# EAGLE design 6301_FP_second_try (EAGLE 7.7.0)
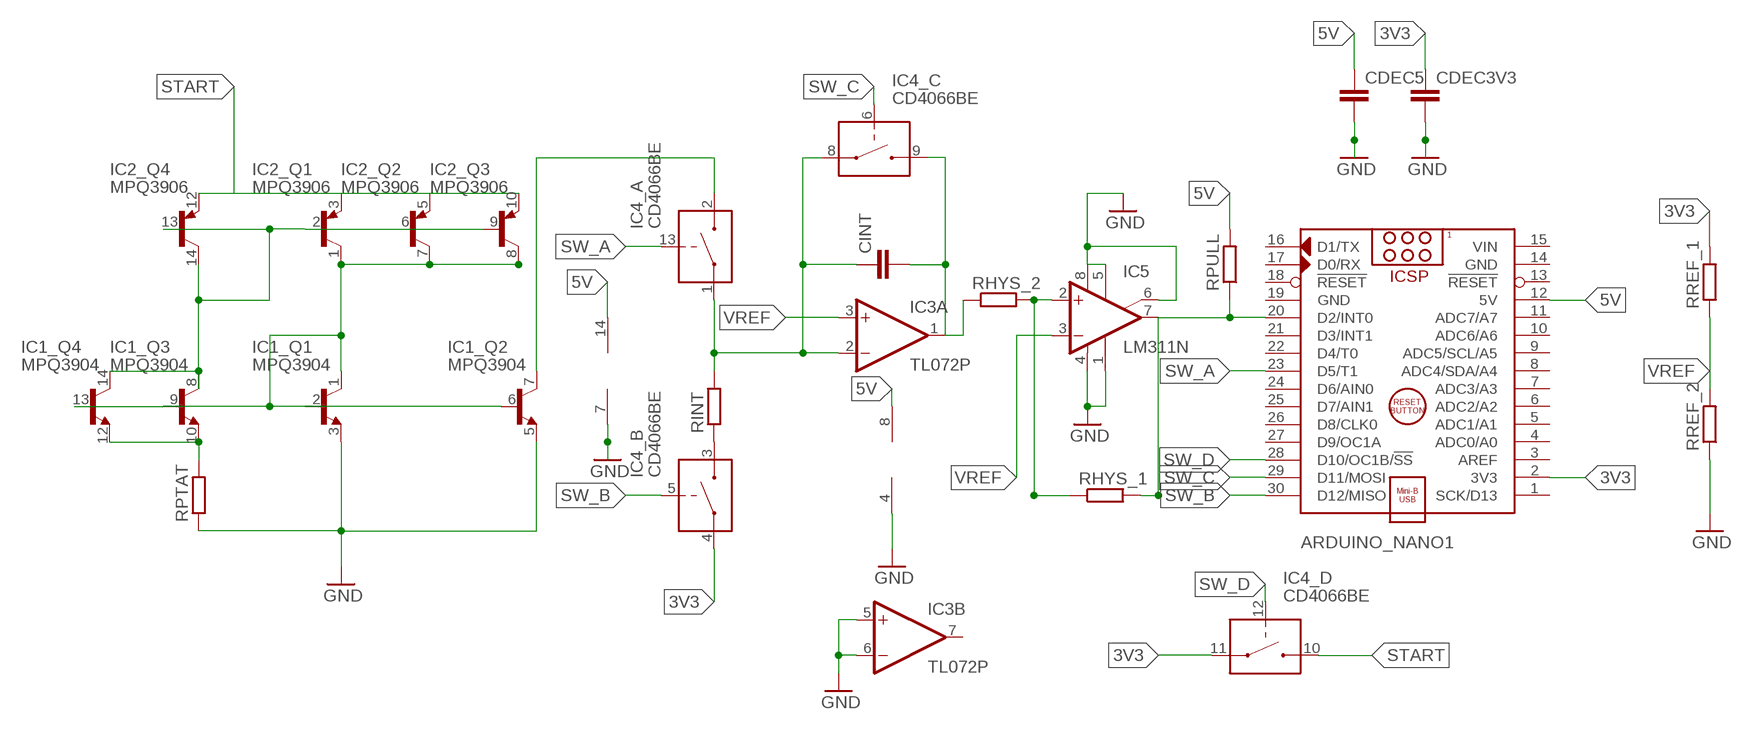
[diagram p0: schematic, sheet 1]

## Parts
ARDUINO_NANO1  ARDUINO_NANO  [ARDUINO_NANO]
CDEC3V3  C-EU025-024X044  [C025-024X044]
CDEC5  C-EU025-024X044  [C025-024X044]
CINT  C-EU025-024X044  [C025-024X044]
IC1  MPQ3904  [DIL14]
IC2  MPQ3906  [DIL14]
IC3  TL072P  [DIL08]
IC4  CD4066BE  [DIL14]
IC5  LM311N  [DIL08]
RHYS_1  R-EU_0204/7  [0204/7]
RHYS_2  R-EU_0204/7  [0204/7]
RINT  R-EU_0204/7  [0204/7]
RPTAT  R-EU_0204/7  [0204/7]
RPULL  R-EU_0204/7  [0204/7]
RREF_1  R-EU_0204/7  [0204/7]
RREF_2  R-EU_0204/7  [0204/7]

## Nets
3V3: ARDUINO_NANO1.2(3V3) CDEC3V3.1 IC4.4(_B:IN/OUT1) IC4.11(_D:IN/OUT1) RREF_1.2
5V: ARDUINO_NANO1.12(5V) CDEC5.1 IC3.8(P:V+) IC4.14(V+) RPULL.2
GND: CDEC3V3.2 CDEC5.2 IC1.3(_Q1:E) IC1.5(_Q2:E) IC3.4(P:V-) IC3.5(B:+IN) IC3.6(B:-IN) IC4.7(V-) IC5.1(GND) IC5.4(V-) IC5.5(ON) IC5.6(ON/STR) IC5.8(V+) RPTAT.1 RREF_2.1
N$1: IC4.3(_B:IN/OUT2) RINT.1
N$2: IC1.10(_Q3:E) IC1.12(_Q4:E) RPTAT.2
N$3: IC1.8(_Q3:C) IC1.14(_Q4:C) IC2.2(_Q1:B) IC2.6(_Q2:B) IC2.9(_Q3:B) IC2.13(_Q4:B) IC2.14(_Q4:C)
N$4: ARDUINO_NANO1.20(D2/INT0) IC5.7(OUT) RHYS_1.2 RPULL.1
N$5: IC1.1(_Q1:C) IC1.2(_Q1:B) IC1.6(_Q2:B) IC1.9(_Q3:B) IC1.13(_Q4:B) IC2.1(_Q1:C) IC2.7(_Q2:C) IC2.8(_Q3:C)
N$6: CINT.2 IC3.1(A:OUT) IC4.9(_C:IN/OUT2) RHYS_2.1
N$9: IC1.7(_Q2:C) IC4.2(_A:IN/OUT2)
N$10: CINT.1 IC3.2(A:-IN) IC4.1(_A:IN/OUT1) IC4.8(_C:IN/OUT1) RINT.2
START: IC2.3(_Q1:E) IC2.5(_Q2:E) IC2.10(_Q3:E) IC2.12(_Q4:E) IC4.10(_D:IN/OUT2)
SW_A: ARDUINO_NANO1.23(D5/T1) IC4.13(_A:CONTROL)
SW_B: ARDUINO_NANO1.30(D12/MISO) IC4.5(_B:CONTROL)
SW_C: ARDUINO_NANO1.29(D11/MOSI) IC4.6(_C:CONTROL)
SW_D: ARDUINO_NANO1.28(D10/OC1B/!SS) IC4.12(_D:CONTROL)
VREF: IC3.3(A:+IN) IC5.2(+IN) IC5.3(-IN) RHYS_1.1 RHYS_2.2 RREF_1.1 RREF_2.2
Unconnected: ARDUINO_NANO1.1(SCK/D13) ARDUINO_NANO1.3(AREF) ARDUINO_NANO1.4(ADC0/A0) ARDUINO_NANO1.5(ADC1/A1) ARDUINO_NANO1.6(ADC2/A2) ARDUINO_NANO1.7(ADC3/A3) ARDUINO_NANO1.8(ADC4/SDA/A4) ARDUINO_NANO1.9(ADC5/SCL/A5) ARDUINO_NANO1.10(ADC6/A6) ARDUINO_NANO1.11(ADC7/A7) ARDUINO_NANO1.13(!RESET) ARDUINO_NANO1.16(D1/TX) ARDUINO_NANO1.17(D0/RX) ARDUINO_NANO1.18(!RESET) ARDUINO_NANO1.21(D3/INT1) ARDUINO_NANO1.22(D4/T0) ARDUINO_NANO1.24(D6/AIN0) ARDUINO_NANO1.25(D7/AIN1) ARDUINO_NANO1.26(D8/CLK0) ARDUINO_NANO1.27(D9/OC1A) IC3.7(B:OUT)

## Power pins joined to a net without a drawn wire
GND: ARDUINO_NANO1.14(GND) ARDUINO_NANO1.19(GND)
VIN: ARDUINO_NANO1.15(VIN)

## Library data of the parts
ARDUINO_NANO1 = 6301-temp-sensor-rev1:ARDUINO_NANO: Arduino Nano V3.0 Module Overview: The Arduino Nano is a small, complete, and breadboard-friendly board based on the ATmega328 (Arduino Nano 3.x) or ATmega168 (Arduino Nano 2.x). It has more or less the same functionality of the Arduino Duemilanove, but in a different package. It lacks only a DC power jack, and works with a Mini-B USB cable instead of a standard one. The Nano was designed and is being produced by Gravitech <http://www.gravitech.us/arna30wiatp.html>. General specifications: Item Value Microcontroller Atmel ATmega168 or ATmega328 Operating Voltage (logic level) 5 V Input Voltage (recommended) 7-12 V Input Voltage (limits) 6-20 V Digital I/O Pins 14 (of which 6 provide PWM output) Analog Input Pins 8 DC Current per I/O Pin 40 mA Flash Memory 16 KB (ATmega168) or 32 KB (ATmega328) of which 2 KB used by bootloader SRAM 1 KB (ATmega168) or 2 KB (ATmega328) EEPROM 512 bytes (ATmega168) or 1 KB (ATmega328) Clock Speed 16 MHz Dimensions (Inches) 0.73" x 1.70" Dimensions (mm) 18mm x 45mm Overall height About 9 mm (not including pins) Weigth 5 g Power: The Arduino Nano can be powered via the Mini-B USB connection, 6-20V unregulated external power supply (pin 30), or 5V regulated external power supply (pin 27). The power source is automatically selected to the highest voltage source. Memory: The ATmega168 has 16 KB of flash memory for storing code (of which 2 KB is used for the bootloader); the ATmega328 has 32 KB, (also with 2 KB used for the bootloader). The ATmega168 has 1 KB of SRAM and 512 bytes of EEPROM (which can be read and written with the EEPROM library); the ATmega328 has 2 KB of SRAM and 1 KB of EEPROM. Input and Output: Each of the 14 digital pins on the Nano can be used as an input or output, using pinMode(), digitalWrite(), and digitalRead() functions. They operate at 5 volts. Each pin can provide or receive a maximum of 40 mA and has an internal pull-up resistor (disconnected by default) of 20-50 kOhms. In addition, some pins have specialized functions. Visit Arduino - ArduinoBoardNano <https://www.arduino.cc/en/Main/ArduinoBoardNano>
CDEC3V3 CDEC5 CINT = rcl:C-EU: CAPACITOR, European symbol
IC1 = 6301-temp-sensor-rev1:MPQ3904
IC2 = 6301-temp-sensor-rev1:MPQ3906
IC3 = 6301-temp-sensor-rev1:TL072: OP AMP
IC4 = 6301-temp-sensor-rev1:CD4066BE
IC5 = 6301-temp-sensor-rev1:LM311: COMPARATOR
RHYS_1 RHYS_2 RINT RPTAT RPULL RREF_1 RREF_2 = rcl:R-EU_: RESISTOR, European symbol

## Net classes
0 default: width 0.406 mm, drill 0.406 mm, clearance 0.406 mm

## Board
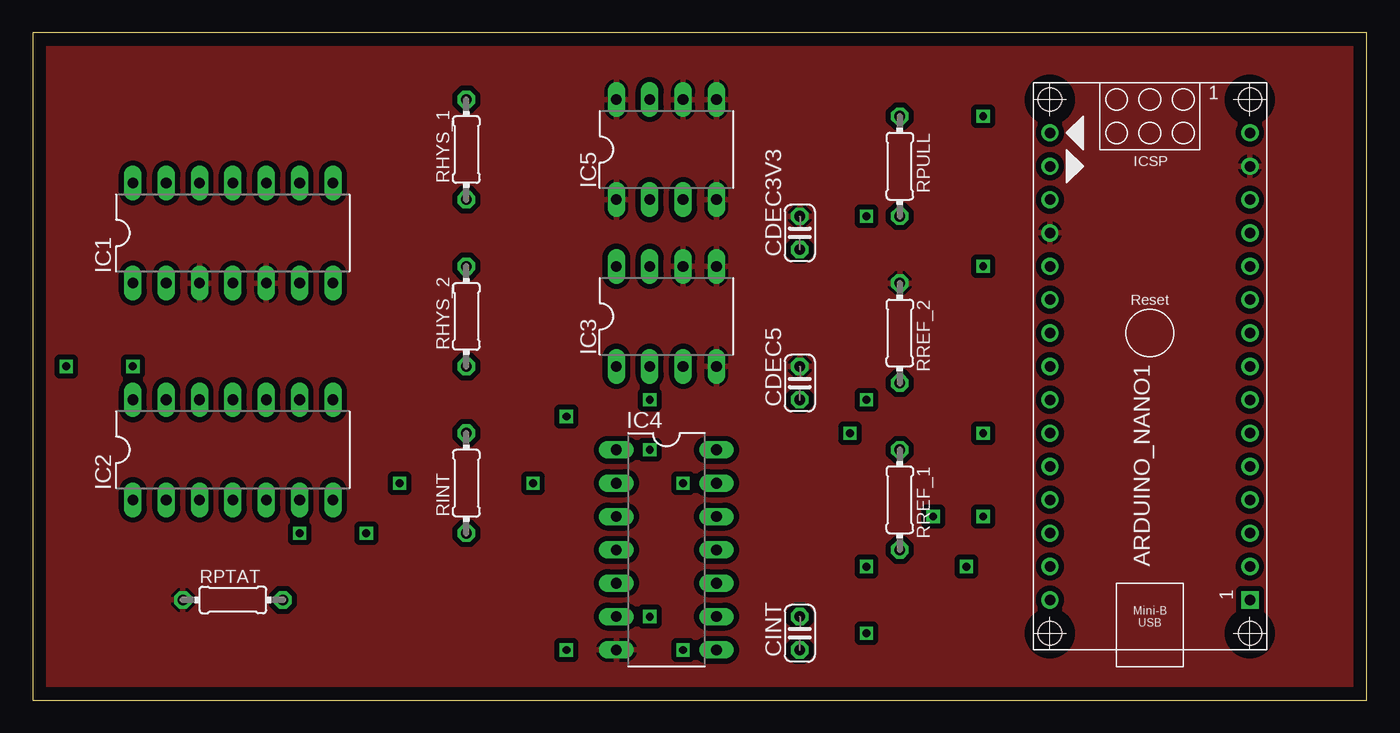
[diagram p1: board, top side]
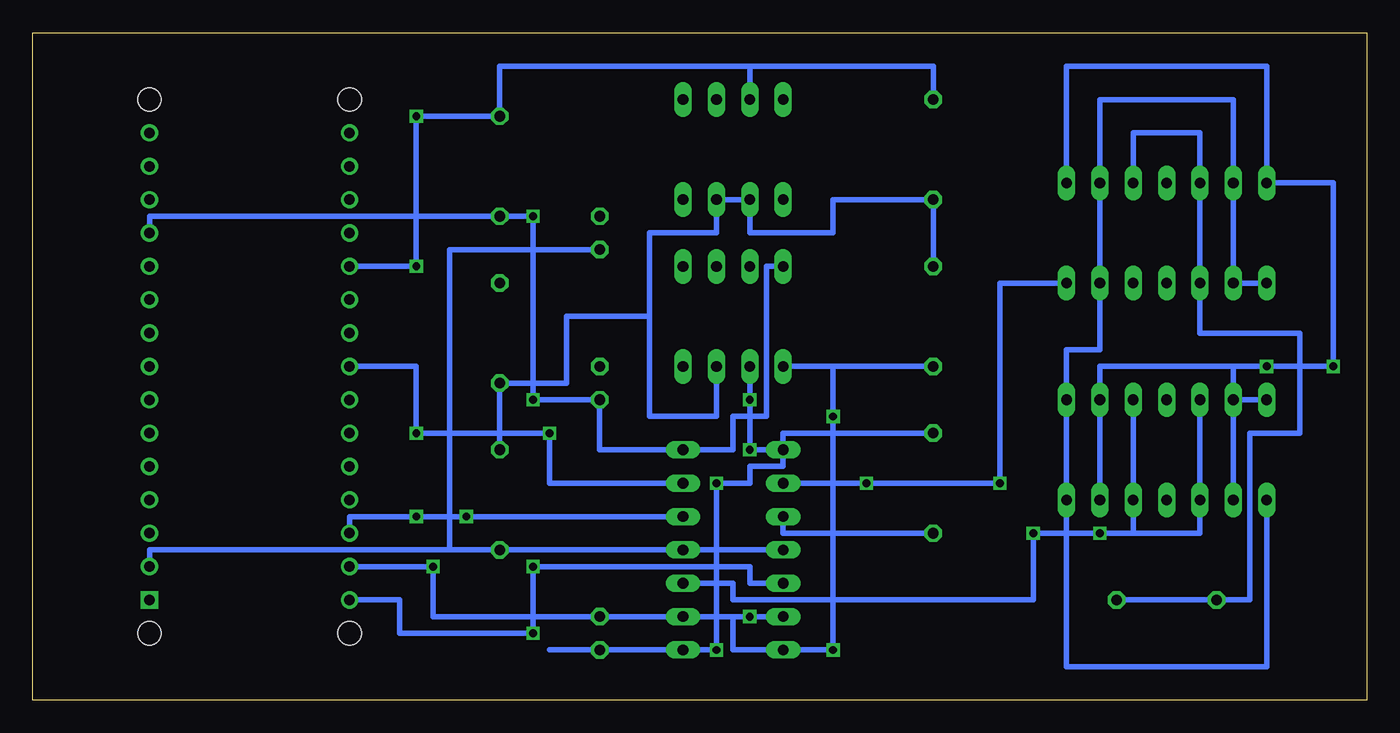
[diagram p2: board, bottom side, seen from below]

Size 101.6 x 50.8 mm. Coordinates in mm from the lower left corner, seen from the top.
Outline: 0,0 101.6,0 101.6,50.8 0,50.8 0,0
Copper layers (1*16): Top 0.035mm / dielectric 1.5mm / Bottom 0.035mm
Design rules "default": minimum track width 10mil, minimum drill 24mil, track to track 8mil, track to pad 8mil, pad to pad 8mil, via to via 8mil, smd to smd 8mil, copper to edge 40mil, drill to drill 8mil, minimum pad ring 10mil, minimum via ring 8mil, stop-mask expansion 4mil, vias tented up to drill 0mil, thermal gap 10mil

### Footprints (pad centres in the part's own frame; a part is rotated, then mirrored left to right if it is on the bottom)
ARDUINO_NANO = drill 0.8 square: 1 -20.32,-7.62 | drill 0.8: 2 -17.78,-7.62; 3 -15.24,-7.62; 4 -12.7,-7.62; 5 -10.16,-7.62; 6 -7.62,-7.62; 7 -5.08,-7.62; 8 -2.54,-7.62; 9 0,-7.62; 10 2.54,-7.62; 11 5.08,-7.62; 12 7.62,-7.62; 13 10.16,-7.62; 14 12.7,-7.62; 15 15.24,-7.62; 16 15.24,7.62; 17 12.7,7.62; 18 10.16,7.62; 19 7.62,7.62; 20 5.08,7.62; 21 2.54,7.62; 22 0,7.62; 23 -2.54,7.62; 24 -5.08,7.62; 25 -7.62,7.62; 26 -10.16,7.62; 27 -12.7,7.62; 28 -15.24,7.62; 29 -17.78,7.62; 30 -20.32,7.62 | hole 1.778: -22.86,-7.62; -22.86,7.62; 17.78,7.62; 17.78,-7.62
C025-024X044 = drill 0.813 octagon: 1 -1.27,0; 2 1.27,0
DIL14 = drill 0.813 long: 1 -7.62,-3.81; 2 -5.08,-3.81; 3 -2.54,-3.81; 4 0,-3.81; 5 2.54,-3.81; 6 5.08,-3.81; 7 7.62,-3.81; 8 7.62,3.81; 9 5.08,3.81; 10 2.54,3.81; 11 0,3.81; 12 -2.54,3.81; 13 -5.08,3.81; 14 -7.62,3.81
DIL08 = drill 0.813 long: 1 -3.81,-3.81; 2 -1.27,-3.81; 3 1.27,-3.81; 4 3.81,-3.81; 5 3.81,3.81; 6 1.27,3.81; 7 -1.27,3.81; 8 -3.81,3.81
0204/7 = drill 0.813 octagon: 1 -3.81,0; 2 3.81,0

### Placement (x,y rotation side)
ARDUINO_NANO1  85.09,27.94 90 top
CDEC3V3  58.42,35.56 90 top
CDEC5  58.42,24.13 90 top
CINT  58.42,5.08 90 top
IC1  15.24,35.56 0 top
IC2  15.24,19.05 0 top
IC3  48.26,29.21 0 top
IC4  48.26,11.43 270 top
IC5  48.26,41.91 0 top
RHYS_1  33.02,41.91 90 top
RHYS_2  33.02,29.21 90 top
RINT  33.02,16.51 90 top
RPTAT  15.24,7.62 0 top
RPULL  66.04,40.64 270 top
RREF_1  66.04,15.24 270 top
RREF_2  66.04,27.94 270 top

### Tracks (layer width: path | path; a pad name or v marks a point on that pad's centre or on a via)
3V3
  Bottom 0.406: CDEC3V3.1 69.85,34.29 69.85,11.43 | 69.85,11.43 RREF_1.2 IC4.11 IC4.4 | 69.85,11.43 92.71,11.43 ARDUINO_NANO1.2
5V  (via drill 0.6)
  Bottom 0.406: ARDUINO_NANO1.12 92.71,36.83 RPULL.2 v63.5,36.83 v63.5,22.86 CDEC5.1 58.42,19.05 IC4.14 48.26,19.05 48.26,21.59 45.72,21.59 45.72,33.02 IC3.8
GND
  pour Top: 0,50.8 0,0 101.6,0 101.6,50.8
N$1
  Bottom 0.406: RINT.1 44.45,12.7 IC4.3
N$2
  Bottom 0.406: IC1.10 17.78,43.18 12.7,43.18 IC1.12 12.7,27.94 5.08,27.94 5.08,20.32 8.89,20.32 8.89,7.62 RPTAT.2
N$3  (via drill 0.6)
  Bottom 0.406: IC1.8 22.86,48.26 7.62,48.26 IC1.14 2.54,39.37 v2.54,25.4 v7.62,25.4 10.16,25.4 | IC2.14 IC2.13 | IC2.13 IC2.2 | IC2.6 IC2.9 20.32,25.4 10.16,25.4 | 10.16,25.4 IC2.13
N$4  (via drill 0.6)
  Bottom 0.406: RHYS_1.2 33.02,48.26 46.99,48.26 | IC5.7 46.99,48.26 | 46.99,48.26 66.04,48.26 RPULL.1 v72.39,44.45 v72.39,33.02 ARDUINO_NANO1.20
N$5
  Bottom 0.406: IC1.1 IC1.2 IC1.13 10.16,45.72 20.32,45.72 IC1.9 IC1.6 20.32,26.67 22.86,26.67 IC2.8 IC2.7 22.86,2.54 7.62,2.54 IC2.1
N$6  (via drill 0.6)
  Bottom 0.406: RHYS_2.1 IC3.1 40.64,25.4 v40.64,21.59 v40.64,3.81 48.26,3.81 48.26,6.35 IC4.9 CINT.2
N$9  (via drill 0.6)
  Bottom 0.406: IC1.7 27.94,31.75 v27.94,16.51 v38.1,16.51 IC4.2
N$10  (via drill 0.6)
  Bottom 0.406: RINT.2 44.45,20.32 IC4.1 | 62.23,3.81 CINT.1 IC4.8 v49.53,3.81 v49.53,16.51 46.99,16.51 46.99,17.78 44.45,17.78 IC4.1 | IC4.1 v46.99,19.05 v46.99,22.86 IC3.2
START  (via drill 0.6)
  Bottom 0.406: 17.78,12.7 IC2.5 IC2.10 | 17.78,12.7 12.7,12.7 IC2.3 IC2.12 | IC4.10 48.26,8.89 48.26,7.62 25.4,7.62 v25.4,12.7 v20.32,12.7 17.78,12.7
SW_A  (via drill 0.6)
  Bottom 0.406: IC4.13 62.23,16.51 v62.23,20.32 v72.39,20.32 72.39,25.4 ARDUINO_NANO1.23
SW_B  (via drill 0.6)
  Bottom 0.406: IC4.5 46.99,8.89 46.99,10.16 v63.5,10.16 v63.5,5.08 73.66,5.08 73.66,7.62 ARDUINO_NANO1.30
SW_C  (via drill 0.6)
  Bottom 0.406: IC4.6 v46.99,6.35 71.12,6.35 v71.12,10.16 ARDUINO_NANO1.29
SW_D  (via drill 0.6)
  Bottom 0.406: IC4.12 v68.58,13.97 v72.39,13.97 77.47,13.97 ARDUINO_NANO1.28
VREF
  Bottom 0.406: RHYS_2.2 RHYS_1.1 40.64,38.1 40.64,35.56 46.99,35.56 IC5.2 IC5.3 49.53,35.56 54.61,35.56 54.61,29.21 | RREF_1.1 RREF_2.2 60.96,24.13 60.96,29.21 54.61,29.21 | 54.61,29.21 54.61,21.59 49.53,21.59 IC3.3